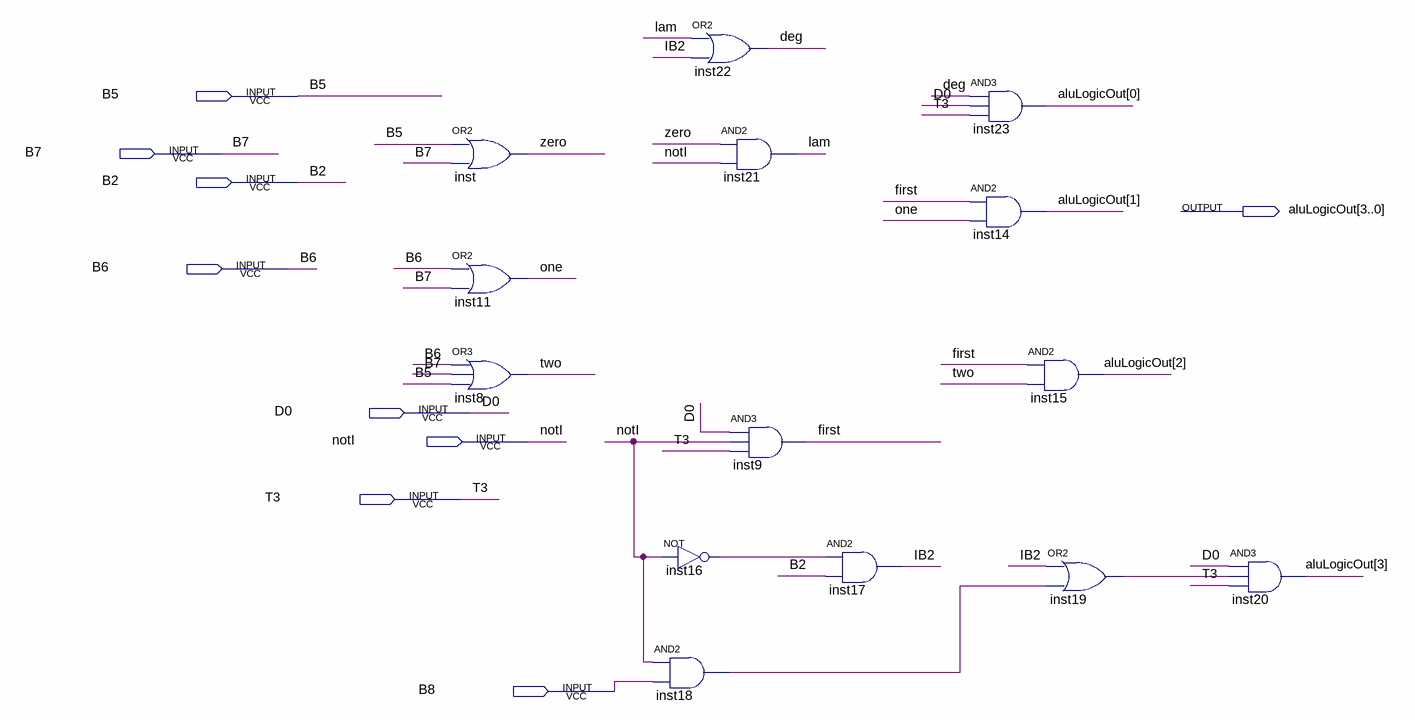
[diagram p0: schematic sheet]
// Quartus schematic ALULogic.bdf as structural Verilog: 14 symbols, 9 pins
module ALULogic (
  input  B5,
  input  B7,
  input  B2,
  input  B6,
  input  D0,
  input  notI,
  input  T3,
  input  B8,
  output [3:0] aluLogicOut
);

  wire deg, first, IB2, inst16_out, inst18_out, inst19_out, lam, one, two, zero;

  or inst (zero, B5, B7);
  or inst11 (one, B6, B7);
  or inst8 (two, B6, B7, B5);
  or inst22 (deg, lam, IB2);
  not inst16 (inst16_out, notI);
  and inst18 (inst18_out, notI, B8);
  and inst21 (lam, zero, notI);
  and inst9 (first, D0, notI, T3);
  and inst17 (IB2, inst16_out, B2);
  and inst23 (aluLogicOut[0], deg, D0, T3);
  and inst14 (aluLogicOut[1], first, one);
  and inst15 (aluLogicOut[2], first, two);
  or inst19 (inst19_out, IB2, inst18_out);
  and inst20 (aluLogicOut[3], D0, inst19_out, T3);
endmodule
